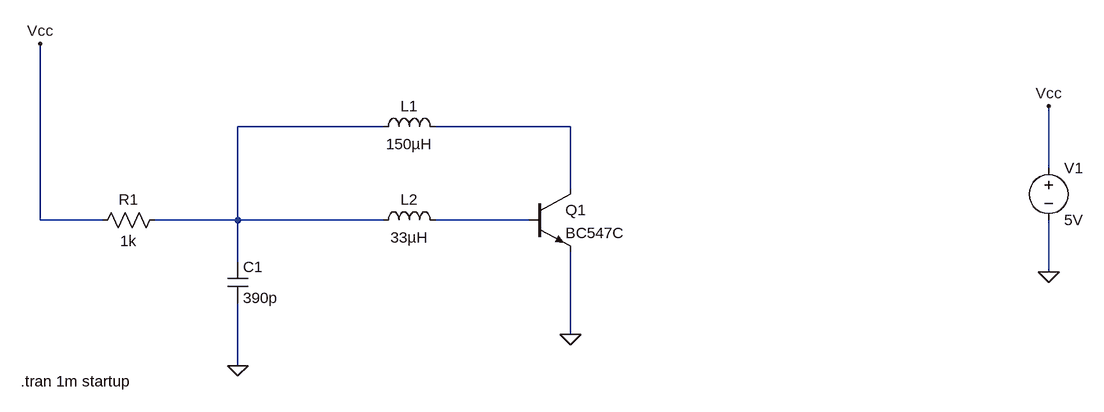
[diagram p0: schematic minati_fig3.asc]
minati_fig3.asc, the LTspice schematic file:
Version 4
SHEET 1 880 680
WIRE -416 0 -640 0
WIRE -128 0 -336 0
WIRE 608 64 608 -32
WIRE -128 96 -128 0
WIRE -944 144 -944 -128
WIRE -848 144 -944 144
WIRE -640 144 -640 0
WIRE -640 144 -768 144
WIRE -416 144 -640 144
WIRE -192 144 -336 144
WIRE -640 208 -640 144
WIRE 608 224 608 144
WIRE -128 320 -128 192
WIRE -640 368 -640 272
FLAG -128 320 0
FLAG -944 -128 Vcc
FLAG -640 368 0
FLAG 608 -32 Vcc
FLAG 608 224 0
SYMBOL npn -192 96 R0
SYMATTR InstName Q1
SYMATTR Value BC547C
SYMBOL ind -432 16 R270
WINDOW 0 32 56 VTop 2
WINDOW 3 5 56 VBottom 2
SYMATTR InstName L1
SYMATTR Value 150µH
SYMBOL ind -432 160 R270
WINDOW 0 32 56 VTop 2
WINDOW 3 5 56 VBottom 2
SYMATTR InstName L2
SYMATTR Value 33µH
SYMBOL cap -656 208 R0
SYMATTR InstName C1
SYMATTR Value 390p
SYMBOL res -752 128 R90
WINDOW 0 0 56 VBottom 2
WINDOW 3 32 56 VTop 2
SYMATTR InstName R1
SYMATTR Value 1k
SYMBOL voltage 608 48 R0
WINDOW 123 0 0 Left 0
WINDOW 39 0 0 Left 0
SYMATTR InstName V1
SYMATTR Value 5V
TEXT -974 392 Left 2 !.tran 1m startup

The netlist it stands for:
* minati_fig3.asc
Q1 N002 N003 0 0 BC547C
L1 N001 N002 150µH
L2 N001 N003 33µH
C1 N001 0 390p
R1 N001 Vcc 1k
V1 Vcc 0 5V
.model NPN NPN
.model PNP PNP
.lib standard.bjt
.tran 1m startup
.backanno
.end